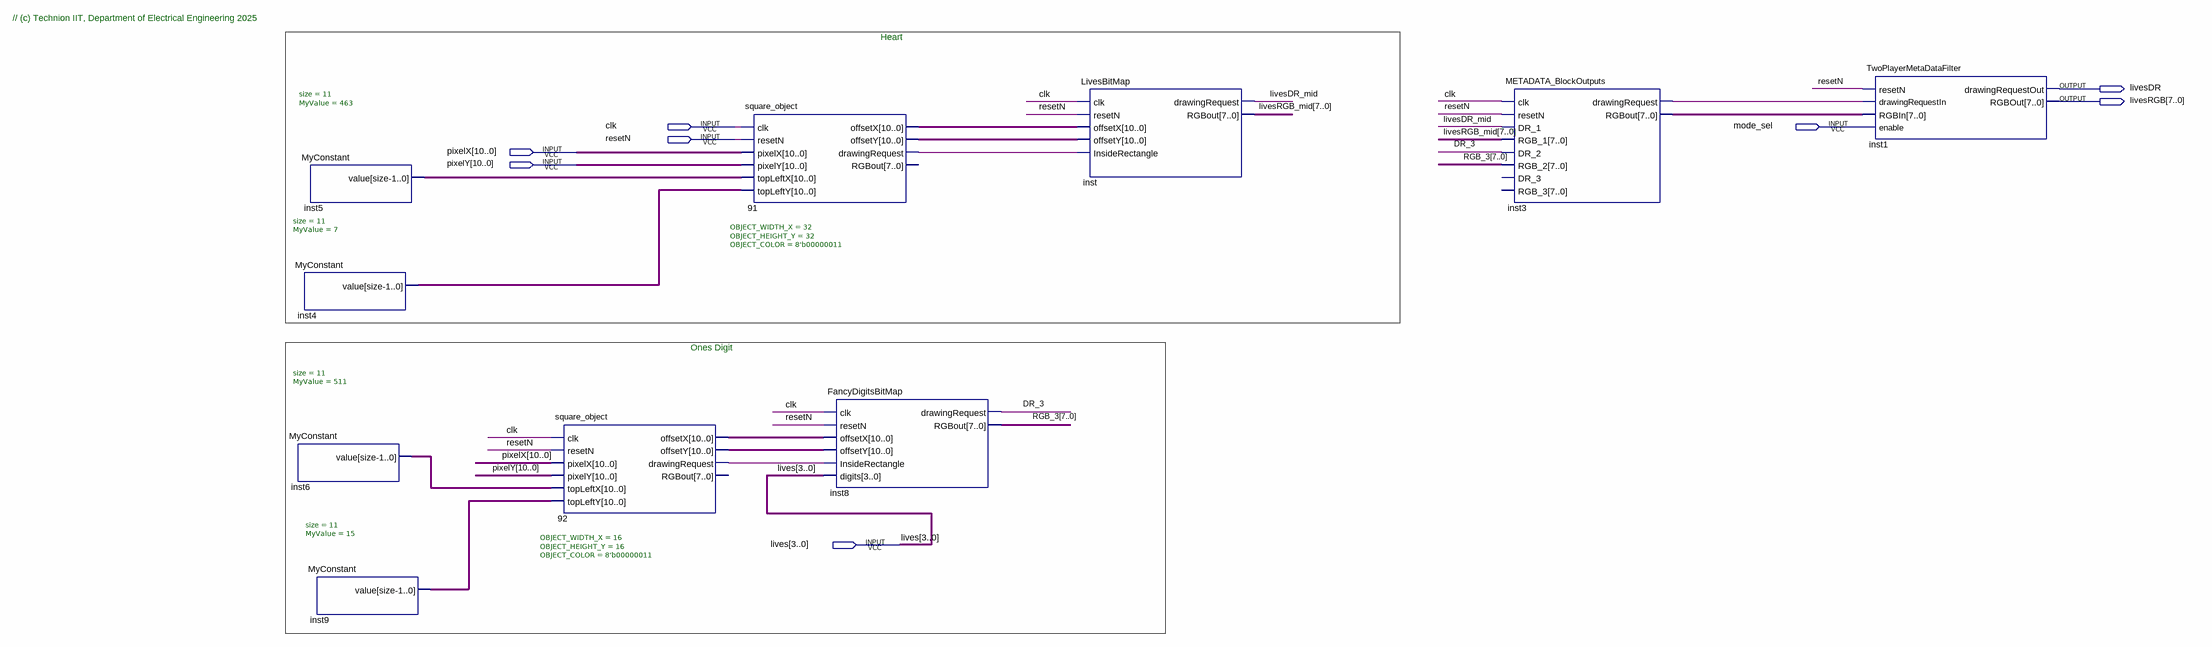
[diagram p0: schematic sheet]
// Quartus schematic Blue_Lives_Block.bdf as structural Verilog: 10 symbols, 8 pins
module Blue_Lives_Block (
  input  clk,
  input  mode_sel,
  input  resetN,
  input  [10:0] pixelX,
  input  [10:0] pixelY,
  input  [3:0] lives,
  output livesDR,
  output [7:0] livesRGB
);

  wire DR_3, inst3_drawingrequest, livesDR_mid, n91_drawingrequest, n92_drawingrequest;
  wire [7:0] inst3_rgbout, livesRGB_mid, RGB_3;
  wire [10:0] inst4_value, inst5_value, inst6_value, inst9_value, n91_offsetx, n91_offsety, n92_offsetx,
       n92_offsety;

  MyConstant #(.size(11), .MyValue(463)) inst5 (.value(inst5_value));
  MyConstant #(.size(11), .MyValue(7)) inst4 (.value(inst4_value));
  MyConstant #(.size(11), .MyValue(511)) inst6 (.value(inst6_value));
  MyConstant #(.size(11), .MyValue(15)) inst9 (.value(inst9_value));
  square_object #(.OBJECT_WIDTH_X(16), .OBJECT_HEIGHT_Y(16), .OBJECT_COLOR(8'b00000011)) u_92 (
    .clk(clk), .resetN(resetN), .pixelX(pixelX), .pixelY(pixelY), .topLeftX(inst6_value),
    .topLeftY(inst9_value), .offsetX(n92_offsetx), .offsetY(n92_offsety), .drawingRequest(n92_drawingrequest));  // open: RGBout
  square_object #(.OBJECT_WIDTH_X(32), .OBJECT_HEIGHT_Y(32), .OBJECT_COLOR(8'b00000011)) u_91 (
    .clk(clk), .resetN(resetN), .pixelX(pixelX), .pixelY(pixelY), .topLeftX(inst5_value),
    .topLeftY(inst4_value), .offsetX(n91_offsetx), .offsetY(n91_offsety), .drawingRequest(n91_drawingrequest));  // open: RGBout
  FancyDigitsBitMap inst8 (
    .clk(clk), .resetN(resetN), .offsetX(n92_offsetx), .offsetY(n92_offsety),
    .InsideRectangle(n92_drawingrequest), .digits(lives), .drawingRequest(DR_3), .RGBout(RGB_3));
  LivesBitMap inst (
    .clk(clk), .resetN(resetN), .offsetX(n91_offsetx), .offsetY(n91_offsety),
    .InsideRectangle(n91_drawingrequest), .drawingRequest(livesDR_mid), .RGBout(livesRGB_mid));
  METADATA_BlockOutputs inst3 (
    .clk(clk), .resetN(resetN), .DR_1(livesDR_mid), .RGB_1(livesRGB_mid), .DR_2(DR_3), .RGB_2(RGB_3),
    .drawingRequest(inst3_drawingrequest), .RGBout(inst3_rgbout));  // open: DR_3, RGB_3
  TwoPlayerMetaDataFilter inst1 (
    .resetN(resetN), .drawingRequestIn(inst3_drawingrequest), .RGBIn(inst3_rgbout), .enable(mode_sel),
    .drawingRequestOut(livesDR), .RGBOut(livesRGB));

  // Notes on the sheet:
  //   // (c) Technion IIT, Department of Electrical Engineering 2025
  //   Heart
  //   Ones Digit 
endmodule
